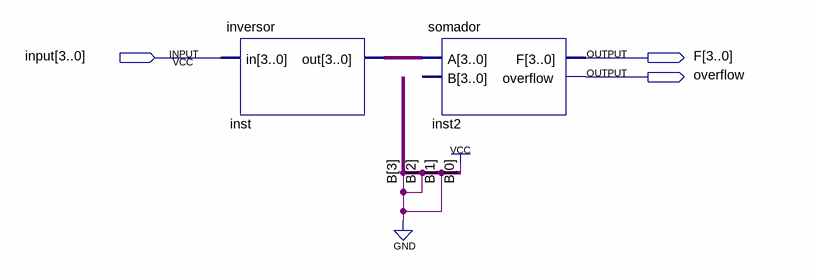
[diagram p0: schematic sheet]
// Quartus schematic complementador.bdf as structural Verilog: 2 symbols, 3 pins
module complementador (
  input  [3:0] \input ,
  output [3:0] F,
  output overflow
);

  wire [3:0] inst_out;

  inversor inst (.in(\input ), .out(inst_out));
  somador inst2 (.A(inst_out), .F(F), .overflow(overflow));  // open: B
endmodule
